# EAGLE schematic cpio (EAGLE 7.5.0)
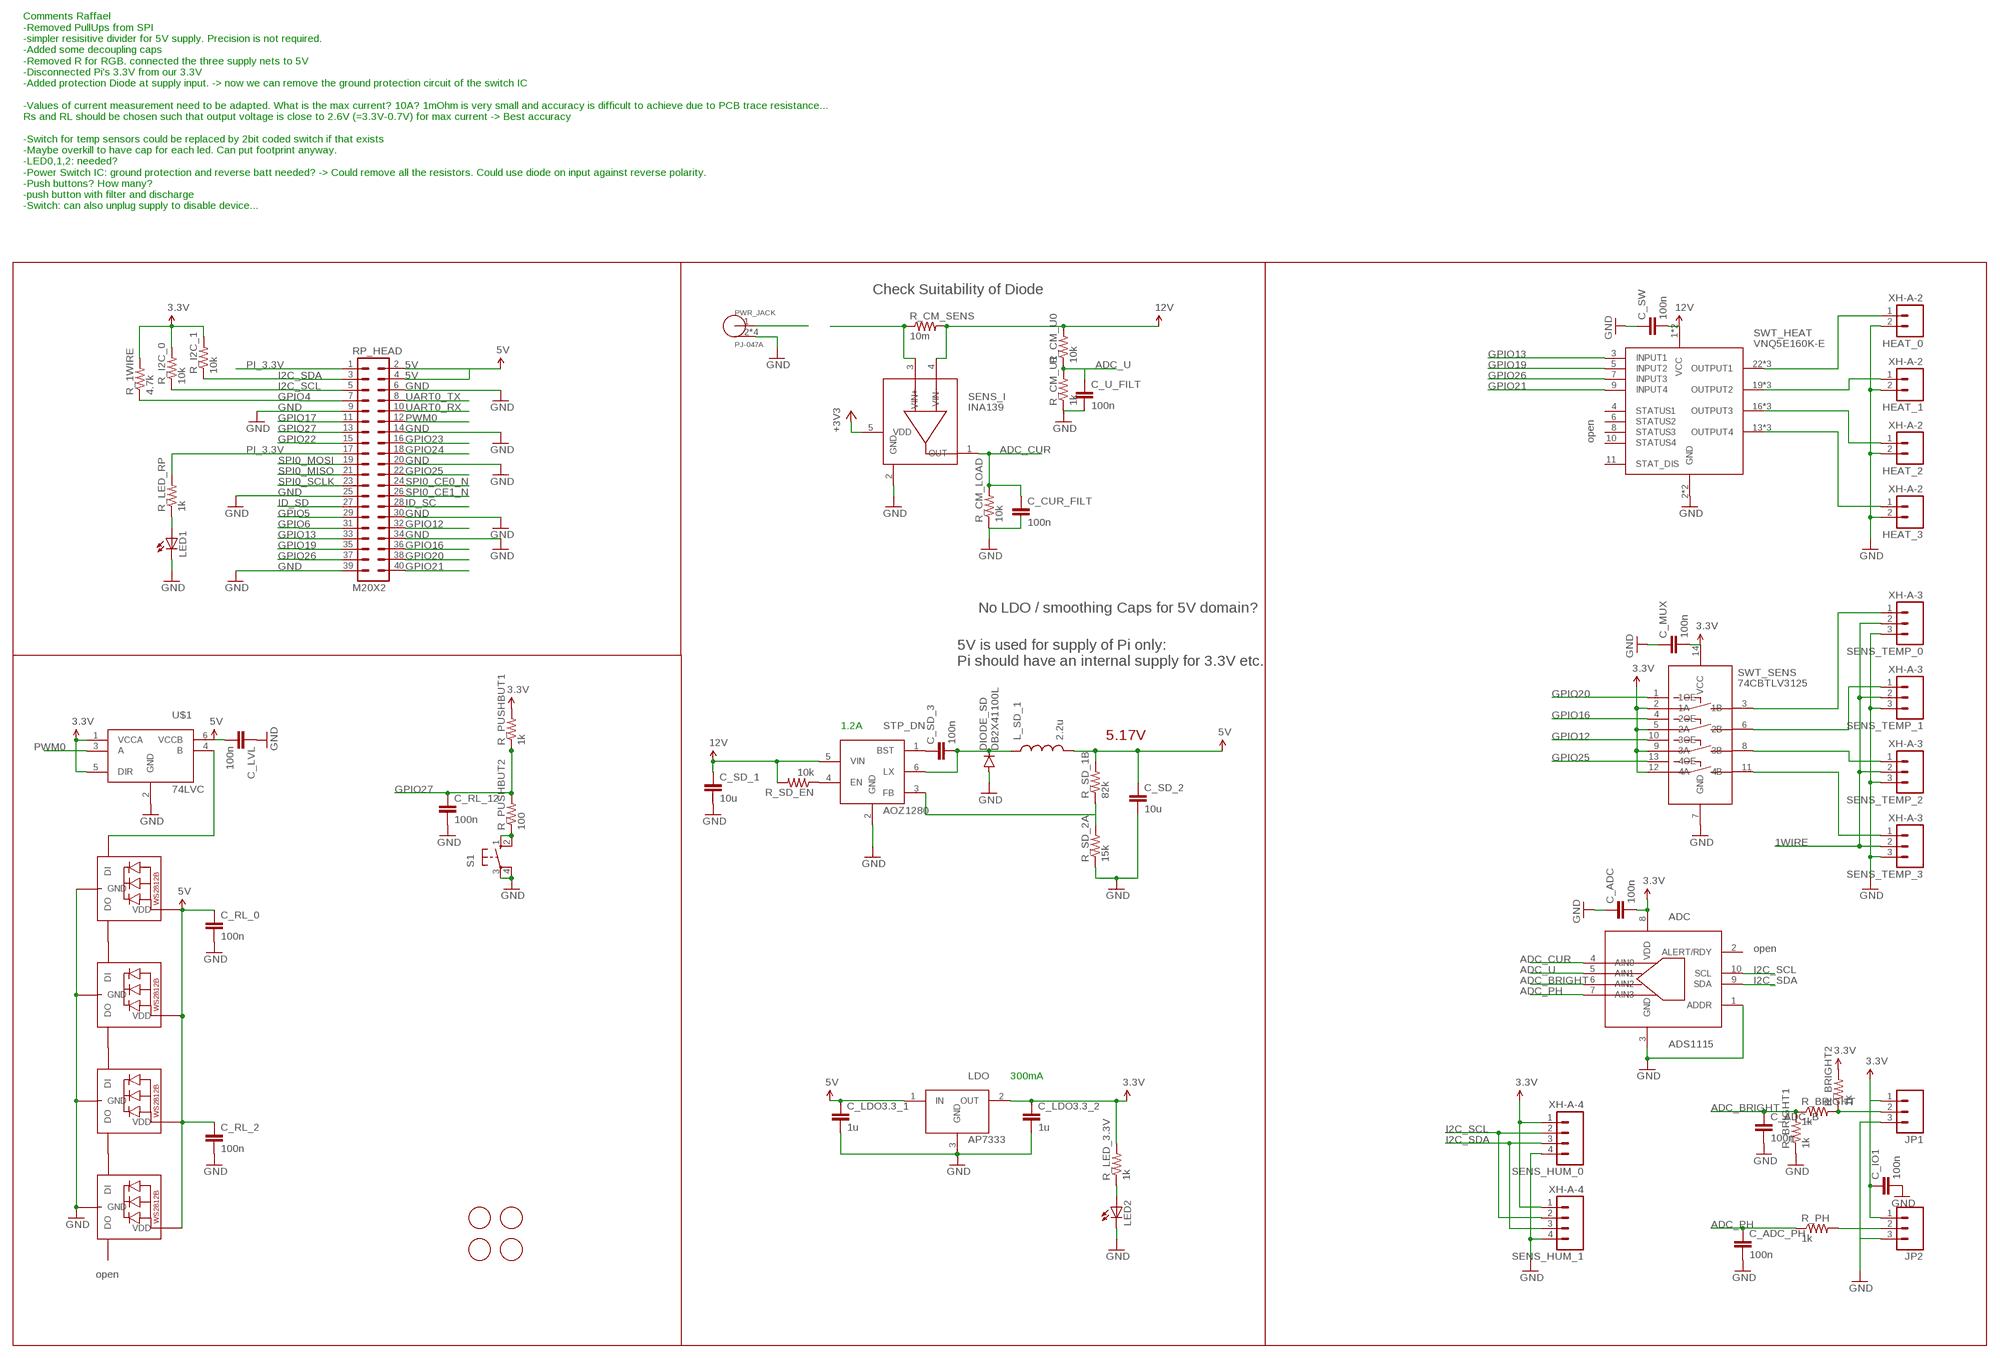
[diagram p0: schematic, sheet 1]

## Parts
ADC  ADS1115  [TFSOP-10]
C_ADC  100n  CAP0805  [0805]
C_ADC_B  100n  CAP0805  [0805]
C_ADC_PH  100n  CAP0805  [0805]
C_CUR_FILT  100n  CAP0805  [0805]
C_IO1  100n  CAP0805  [0805]
C_LDO3.3_1  1u  CAP0805  [0805]
C_LDO3.3_2  1u  CAP0805  [0805]
C_LVL  100n  CAP0805  [0805]
C_MUX  100n  CAP0805  [0805]
C_RL_0  100n  CAP0805  [0805]
C_RL_2  100n  CAP0805  [0805]
C_RL_12  100n  CAP0805  [0805]
C_SD_1  10u  CAP0805  [0805]
C_SD_2  10u  CAP0805  [0805]
C_SD_3  100n  CAP0805  [0805]
C_SW  100n  CAP0805  [0805]
C_U_FILT  100n  CAP0805  [0805]
DIODE_SD  DB2X41100L  [SOD-123FL]
HEAT_0  XH-A-2  [XH-A-2]
HEAT_1  XH-A-2  [XH-A-2]
HEAT_2  XH-A-2  [XH-A-2]
HEAT_3  XH-A-2  [XH-A-2]
JP1  M03PTH  [1X03]
JP2  M03PTH  [1X03]
L_SD_1  2.2u  INDUCTOR0805  [0805]
LDO  AP7333  [SOT23-3]
LED1  LEDSML0805  [SML0805]
LED2  LEDSML0805  [SML0805]
PWR_JACK  PJ-047A  [PJ-047A]
R_1WIRE  4.7k  RESISTOR0805-RES  [0805]
R_BRIGHT  1k  RESISTOR0805-RES  [0805]
R_BRIGHT1  1k  RESISTOR0805-RES  [0805]
R_BRIGHT2  1k  RESISTOR0805-RES  [0805]
R_CM_LOAD  10k  RESISTOR0805-RES  [0805]
R_CM_SENS  10m  RESISTOR0805-RES  [0805]
R_CM_U0  10k  RESISTOR0805-RES  [0805]
R_CM_U1  1k  RESISTOR0805-RES  [0805]
R_I2C_0  10k  RESISTOR0805-RES  [0805]
R_I2C_1  10k  RESISTOR0805-RES  [0805]
R_LED_3.3V  1k  RESISTOR0805-RES  [0805]
R_LED_RP  1k  RESISTOR0805-RES  [0805]
R_PH  1k  RESISTOR0805-RES  [0805]
R_PUSHBUT1  1k  RESISTOR0805-RES  [0805]
R_PUSHBUT2  100  RESISTOR0805-RES  [0805]
R_SD_1B  82k  RESISTOR0805-RES  [0805]
R_SD_2A  15k  RESISTOR0805-RES  [0805]
R_SD_EN  10k  RESISTOR0805-RES  [0805]
RL_HEAT_0  WS2812B5050  [WS2812B]
RL_HEAT_1  WS2812B5050  [WS2812B]
RL_HEAT_2  WS2812B5050  [WS2812B]
RL_HEAT_3  WS2812B5050  [WS2812B]
RP_HEAD  M20X2  [2X20]
S1  10-XX  [B3F-10XX]
SENS_HUM_0  XH-A-4  [XH-A-4]
SENS_HUM_1  XH-A-4  [XH-A-4]
SENS_I  INA139  [SOT23-5]
SENS_TEMP_0  XH-A-3  [XH-A-3]
SENS_TEMP_1  XH-A-3  [XH-A-3]
SENS_TEMP_2  XH-A-3  [XH-A-3]
SENS_TEMP_3  XH-A-3  [XH-A-3]
STP_DN  AOZ1280  [SOT23-6]
SWT_HEAT  VNQ5E160K-E  [POWERSSO-24]
SWT_SENS  74CBTLV3125  [TSSOP-14]
U$1  74LVC  [SOT-363]
U$3  SPACERHOLE  [HOLE]
U$4  SPACERHOLE  [HOLE]
U$5  SPACERHOLE  [HOLE]
U$6  SPACERHOLE  [HOLE]

## Nets
1WIRE: SENS_TEMP_0.2 SENS_TEMP_1.2 SENS_TEMP_2.2 SENS_TEMP_3.2
3.3V: ADC.8(VDD) C_ADC.2 C_IO1.1 C_LDO3.3_2.1 JP1.1 JP2.1 LDO.2(OUT) R_1WIRE.2 R_BRIGHT2.2 R_I2C_0.2 R_I2C_1.2 R_LED_3.3V.2 R_PUSHBUT1.2 SENS_HUM_0.1 SENS_HUM_1.1 SWT_SENS.2(1A) SWT_SENS.5(2A) SWT_SENS.9(3A) SWT_SENS.12(4A) SWT_SENS.14(VCC) U$1.1(VCCA) U$1.5(DIR)
3.3V1: C_MUX.2
3.3V2: C_SW.2
3.3V3: C_LVL.2
5V: C_LDO3.3_1.1 C_RL_0.1 C_RL_2.1 C_SD_2.1 L_SD_1.2 LDO.1(IN) R_SD_1B.2 RL_HEAT_0.1-VDD(VDD) RL_HEAT_1.1-VDD(VDD) RL_HEAT_2.1-VDD(VDD) RL_HEAT_3.1-VDD(VDD) RP_HEAD.2 RP_HEAD.4 U$1.6(VCCB)
12V: C_SD_1.1 R_CM_SENS.2 R_CM_U0.2 R_SD_EN.2 SENS_I.4(VIN-) STP_DN.5(VIN) SWT_HEAT.1(VCC) SWT_HEAT.12(VCC)
+3V3: SENS_I.5(VDD)
ADC_BRIGHT: ADC.6(AIN2) C_ADC_B.1 R_BRIGHT1.2 R_BRIGHT.1
ADC_CUR: ADC.4(AIN0) C_CUR_FILT.1 R_CM_LOAD.2 SENS_I.1(OUT)
ADC_PH: ADC.7(AIN3) C_ADC_PH.1 R_PH.1
ADC_U: ADC.5(AIN1) C_U_FILT.1 R_CM_U0.1 R_CM_U1.2
GND: ADC.1(ADDR) ADC.3(GND) C_ADC.1 C_ADC_B.2 C_ADC_PH.2 C_IO1.2 C_LDO3.3_1.2 C_LDO3.3_2.2 C_LVL.1 C_MUX.1 C_RL_0.2 C_RL_2.2 C_RL_12.2 C_SD_1.2 C_SD_2.2 C_SW.1 C_U_FILT.2 DIODE_SD.A HEAT_0.2 HEAT_1.2 HEAT_2.2 HEAT_3.2 JP1.3 JP2.3 LDO.3(GND) LED1.C LED2.C PWR_JACK.2(GND) PWR_JACK.3(GND) PWR_JACK.CASE0(GND) PWR_JACK.CASE1(GND) R_BRIGHT1.1 R_CM_LOAD.1 R_CM_U1.1 R_SD_2A.1 RL_HEAT_0.3-GND(GND) RL_HEAT_1.3-GND(GND) RL_HEAT_2.3-GND(GND) RL_HEAT_3.3-GND(GND) RP_HEAD.6 RP_HEAD.14 RP_HEAD.20 RP_HEAD.30 RP_HEAD.34 S1.3(P) S1.4(P1) SENS_HUM_0.4 SENS_HUM_1.4 SENS_I.2(GND) SENS_TEMP_0.3 SENS_TEMP_1.3 SENS_TEMP_2.3 SENS_TEMP_3.3 STP_DN.2(GND) SWT_SENS.7(GND) U$1.2(GND)
GPIO4: R_1WIRE.1
GPIO12: RP_HEAD.32 SWT_SENS.10(3OE)
GPIO13: SWT_HEAT.3(INPUT1)
GPIO16: RP_HEAD.36 SWT_SENS.4(2OE)
GPIO19: SWT_HEAT.5(INPUT2)
GPIO20: RP_HEAD.38 SWT_SENS.1(1OE)
GPIO21: RP_HEAD.40 SWT_HEAT.9(INPUT4)
GPIO23: RP_HEAD.16
GPIO24: RP_HEAD.18
GPIO25: RP_HEAD.22 SWT_SENS.13(4OE)
GPIO26: SWT_HEAT.7(INPUT3)
GPIO27: C_RL_12.1 R_PUSHBUT1.1 R_PUSHBUT2.2
I2C_SCL: ADC.10(SCL) R_I2C_0.1 SENS_HUM_0.2 SENS_HUM_1.2
I2C_SDA: ADC.9(SDA) R_I2C_1.1 SENS_HUM_0.3 SENS_HUM_1.3
ID_SC: RP_HEAD.28
N$1: RP_HEAD.3 RP_HEAD.5 RP_HEAD.7 RP_HEAD.9 RP_HEAD.11 RP_HEAD.13 RP_HEAD.15 RP_HEAD.19 RP_HEAD.21 RP_HEAD.23 RP_HEAD.25 RP_HEAD.27 RP_HEAD.29 RP_HEAD.31 RP_HEAD.33 RP_HEAD.35 RP_HEAD.37 RP_HEAD.39
N$2: R_PUSHBUT2.1 S1.1(S) S1.2(S1)
N$3: PWR_JACK.1(PWR)
N$6: R_SD_EN.1 STP_DN.4(EN)
N$7: JP2.2 R_PH.2
N$8: C_SD_3.1 STP_DN.1(BST)
N$9: R_SD_1B.1
N$10: C_SD_3.2 DIODE_SD.C L_SD_1.1 STP_DN.6(LX)
N$12: STP_DN.3(FB)
N$13: R_SD_2A.2
N$15: LED2.A R_LED_3.3V.1
N$16: SENS_TEMP_1.1 SWT_SENS.6(2B)
N$17: SENS_TEMP_0.1 SWT_SENS.3(1B)
N$18: SENS_TEMP_2.1 SWT_SENS.8(3B)
N$19: SENS_TEMP_3.1 SWT_SENS.11(4B)
N$20: LED1.A R_LED_RP.1
N$24: R_CM_SENS.1 SENS_I.3(VIN+)
N$26: HEAT_2.1 SWT_HEAT.16(OUTPUT3) SWT_HEAT.17(OUTPUT3) SWT_HEAT.18(OUTPUT3)
N$27: HEAT_1.1 SWT_HEAT.19(OUTPUT2) SWT_HEAT.20(OUTPUT2) SWT_HEAT.21(OUTPUT2)
N$28: HEAT_0.1 SWT_HEAT.22(OUTPUT1) SWT_HEAT.23(OUTPUT1) SWT_HEAT.24(OUTPUT1)
N$29: HEAT_3.1 SWT_HEAT.13(OUTPUT4) SWT_HEAT.14(OUTPUT4) SWT_HEAT.15(OUTPUT4)
N$35: JP1.2 R_BRIGHT2.1 R_BRIGHT.2
N$43: RL_HEAT_2.2-DOUT(DO) RL_HEAT_3.4-DIN(DI)
N$44: RL_HEAT_1.2-DOUT(DO) RL_HEAT_2.4-DIN(DI)
N$45: RL_HEAT_0.2-DOUT(DO) RL_HEAT_1.4-DIN(DI)
N$53: RL_HEAT_0.4-DIN(DI) U$1.4(B)
PI_3.3V: R_LED_RP.2 RP_HEAD.1 RP_HEAD.17
PWM0: RP_HEAD.12 U$1.3(A)
SPI0_CE0_N: RP_HEAD.24
SPI0_CE1_N: RP_HEAD.26
UART0_RX: RP_HEAD.10
UART0_TX: RP_HEAD.8
Unconnected: ADC.2(ALERT/RDY) C_CUR_FILT.2 RL_HEAT_3.2-DOUT(DO) SWT_HEAT.4(STATUS1) SWT_HEAT.6(STATUS2) SWT_HEAT.8(STATUS3) SWT_HEAT.10(STATUS4) SWT_HEAT.11(STAT_DIS)

## Notes on the sheet
- Comments Raffael
  -Removed PullUps from SPI
  -simpler resisitive divider for 5V supply. Precision is not required.
  -Added some decoupling caps
  -Removed R for RGB. connected the three supply nets to 5V
  -Disconnected Pi's 3.3V from our 3.3V
  -Added protection Diode at supply input. -> now we can remove the ground protection circuit of the switch IC
  
  -Values of current measurement need to be adapted. What is the max current? 10A? 1mOhm is very small and accuracy is difficult to achieve due to PCB trace resistance... 
  Rs and RL should be chosen such that output voltage is close to 2.6V (=3.3V-0.7V) for max current -> Best accuracy 
  
  -Switch for temp sensors could be replaced by 2bit coded switch if that exists
  -Maybe overkill to have cap for each led. Can put footprint anyway.
  -LED0,1,2: needed?
  -Power Switch IC: ground protection and reverse batt needed? -> Could remove all the resistors. Could use diode on input against reverse polarity.
  -Push buttons? How many?
  -push button with filter and discharge
  -Switch: can also unplug supply to disable device...
- Check Suitability of Diode
- open
- No LDO / smoothing Caps for 5V domain?
- 5V is used for supply of Pi only: 
  Pi should have an internal supply for 3.3V etc.
- 1.2A
- 5.17V
- open
- 300mA
- open

## Power pins joined to a net without a drawn wire
GND: SWT_HEAT.2(GND) SWT_HEAT.PAD(GND)

## Library data of the parts
ADC = cpio:ADS1115: Ultra-Small, Low-Power, 16-Bit, Analog-to-Digital Converter with Internal Reference
C_ADC C_ADC_B C_ADC_PH C_CUR_FILT C_IO1 C_LDO3.3_1 C_LDO3.3_2 C_LVL C_MUX C_RL_0 C_RL_2 C_RL_12 C_SD_1-C_SD_3 C_SW C_U_FILT = SparkFun-Passives:CAP: Capacitor Standard 0603 ceramic capacitor, and 0.1" leaded capacitor.
DIODE_SD = cpio:DB2X41100L: Diode: Silicon epitaxial planar type
HEAT_0 HEAT_1-HEAT_3 = cpio:XH-A-2: XH-A-2 Connector, 2.5mm pitch, disconnectable crimp style connector
JP1 JP2 = SparkFun-Connectors:M03: Header 3 Standard 3-pin 0.1" header. Use with straight break away headers (SKU : PRT-00116), right angle break away headers (PRT-00553), swiss pins (PRT-00743), machine pins (PRT-00117), and female headers (PRT-00115). Molex polarized connector foot print use with SKU : PRT-08232 with associated crimp pins and housings.
L_SD_1 = SparkFun-Passives:INDUCTOR: Inductors Basic Inductor/Choke - 0603 and 1206. Footprints are not proven and vary greatly between part numbers. INDUCTOR POWER 3.3UH 4.0A SMD 0.197" L x 0.197" W x 0.177" H (5.00mm x 5.00mm x 4.50mm)
LDO = cpio:AP7333: 300mA, Low Quiescent Current, Fast Transient, Low Dropout Linear Regulator (LDO)
LED1 LED2 = led:LED: LED OSRAM: - CHIPLED LG R971, LG N971, LY N971, LG Q971, LY Q971, LO R971, LY R971 LH N974, LH R974 LS Q976, LO Q976, LY Q976 LO Q996 - Hyper CHIPLED LW Q18S LB Q993, LB Q99A, LB R99A - SideLED LS A670, LO A670, LY A670, LG A670, LP A670 LB A673, LV A673, LT A673, LW A673 LH A674 LY A675 LS A676, LA A676, LO A676, LY A676, LW A676 LS A679, LY A679, LG A679 - Hyper Micro SIDELED® LS Y876, LA Y876, LO Y876, LY Y876 LT Y87S - SmartLED LW L88C, LW L88S LB L89C, LB L89S, LG L890 LS L89K, LO L89K, LY L89K LS L896, LA L896, LO L896, LY L896 - TOPLED LS T670, LO T670, LY T670, LG T670, LP T670 LSG T670, LSP T670, LSY T670, LOP T670, LYG T670 LG T671, LOG T671, LSG T671 LB T673, LV T673, LT T673, LW T673 LH T674 LS T676, LA T676, LO T676, LY T676, LB T676, LH T676, LSB T676, LW T676 LB T67C, LV T67C, LT T67C, LS T67K, LO T67K, LY T67K, LW E67C LS E67B, LA E67B, LO E67B, LY E67B, LB E67C, LV E67C, LT E67C LW T67C LS T679, LY T679, LG T679 LS T770, LO T770, LY T770, LG T770, LP T770 LB T773, LV T773, LT T773, LW T773 LH T774 LS E675, LA E675, LY E675, LS T675 LS T776, LA T776, LO T776, LY T776, LB T776 LHGB T686 LT T68C, LB T68C - Hyper Mini TOPLED® LB M676 - Mini TOPLED Santana® LG M470 LS M47K, LO M47K, LY M47K Source: http://www.osram.convergy.de LUXEON: - LUMILED® LXK2-PW12-R00, LXK2-PW12-S00, LXK2-PW14-U00, LXK2-PW14-V00 LXK2-PM12-R00, LXK2-PM12-S00, LXK2-PM14-U00 LXK2-PE12-Q00, LXK2-PE12-R00, LXK2-PE12-S00, LXK2-PE14-T00, LXK2-PE14-U00 LXK2-PB12-K00, LXK2-PB12-L00, LXK2-PB12-M00, LXK2-PB14-N00, LXK2-PB14-P00, LXK2-PB14-Q00 LXK2-PR12-L00, LXK2-PR12-M00, LXK2-PR14-Q00, LXK2-PR14-R00 LXK2-PD12-Q00, LXK2-PD12-R00, LXK2-PD12-S00 LXK2-PH12-R00, LXK2-PH12-S00 LXK2-PL12-P00, LXK2-PL12-Q00, LXK2-PL12-R00 Source: www.luxeon.com KINGBRIGHT: KA-3528ASYC Source: www.kingbright.com
PWR_JACK = cpio:PJ-047A: DC Power Jack PJ-047A, 2.0 mm center pin, 2.5 A rating, right angle orientation, through hole, shielded
R_1WIRE R_BRIGHT R_BRIGHT1 R_BRIGHT2 R_CM_LOAD R_CM_SENS R_CM_U0 R_CM_U1 R_I2C_0 R_I2C_1 R_LED_3.3V R_LED_RP R_PH R_PUSHBUT1 R_PUSHBUT2 R_SD_1B R_SD_2A R_SD_EN = SparkFun-Passives:RESISTOR: Resistor Basic schematic elements and footprints for 0603, 1206, and PTH resistors.
RL_HEAT_0 RL_HEAT_1-RL_HEAT_3 = adafruit:WS2812B
RP_HEAD = SparkFun-Connectors:M20X2: 0.1" spaced headers
S1 = switch-omron:10-XX: OMRON SWITCH; MPN: B3F-1000; OC_FARNELL: 176432; OC_NEWARK: 36M3542
SENS_HUM_0 SENS_HUM_1 = cpio:XH-A-4: XH-A-4 Connector, 2.5mm pitch, disconnectable crimp style connector
SENS_I = cpio:INA139: High-Side Measurement Current Shunt Monitor
SENS_TEMP_0 SENS_TEMP_1-SENS_TEMP_3 = cpio:XH-A-3: XH-A-3 Connector, 2.5mm pitch, disconnectable crimp style connector
STP_DN = cpio:AOZ1280: EZBuck 1.2 A Simple Buck Regulator
SWT_HEAT = cpio:VNQ5E160K-E: Quad channel high side driver for automotive applications
SWT_SENS = cpio:74CBTLV3125: 4-bit bus switch
U$1 = cpio:74LVC: Level Shifter (1.2 to 5.5V), Dual supply translating transceiver, 3-state
U$3-U$6 = cpio:SPACERHOLE: M2.5 2.75±0.05mm Raspberry Pi Spacer Hole